# Altium schematic sheet 10scm153adp1_main.SchDoc
size A3; DocumentNumber: 1; SheetNumber: 1; SheetTotal: 3
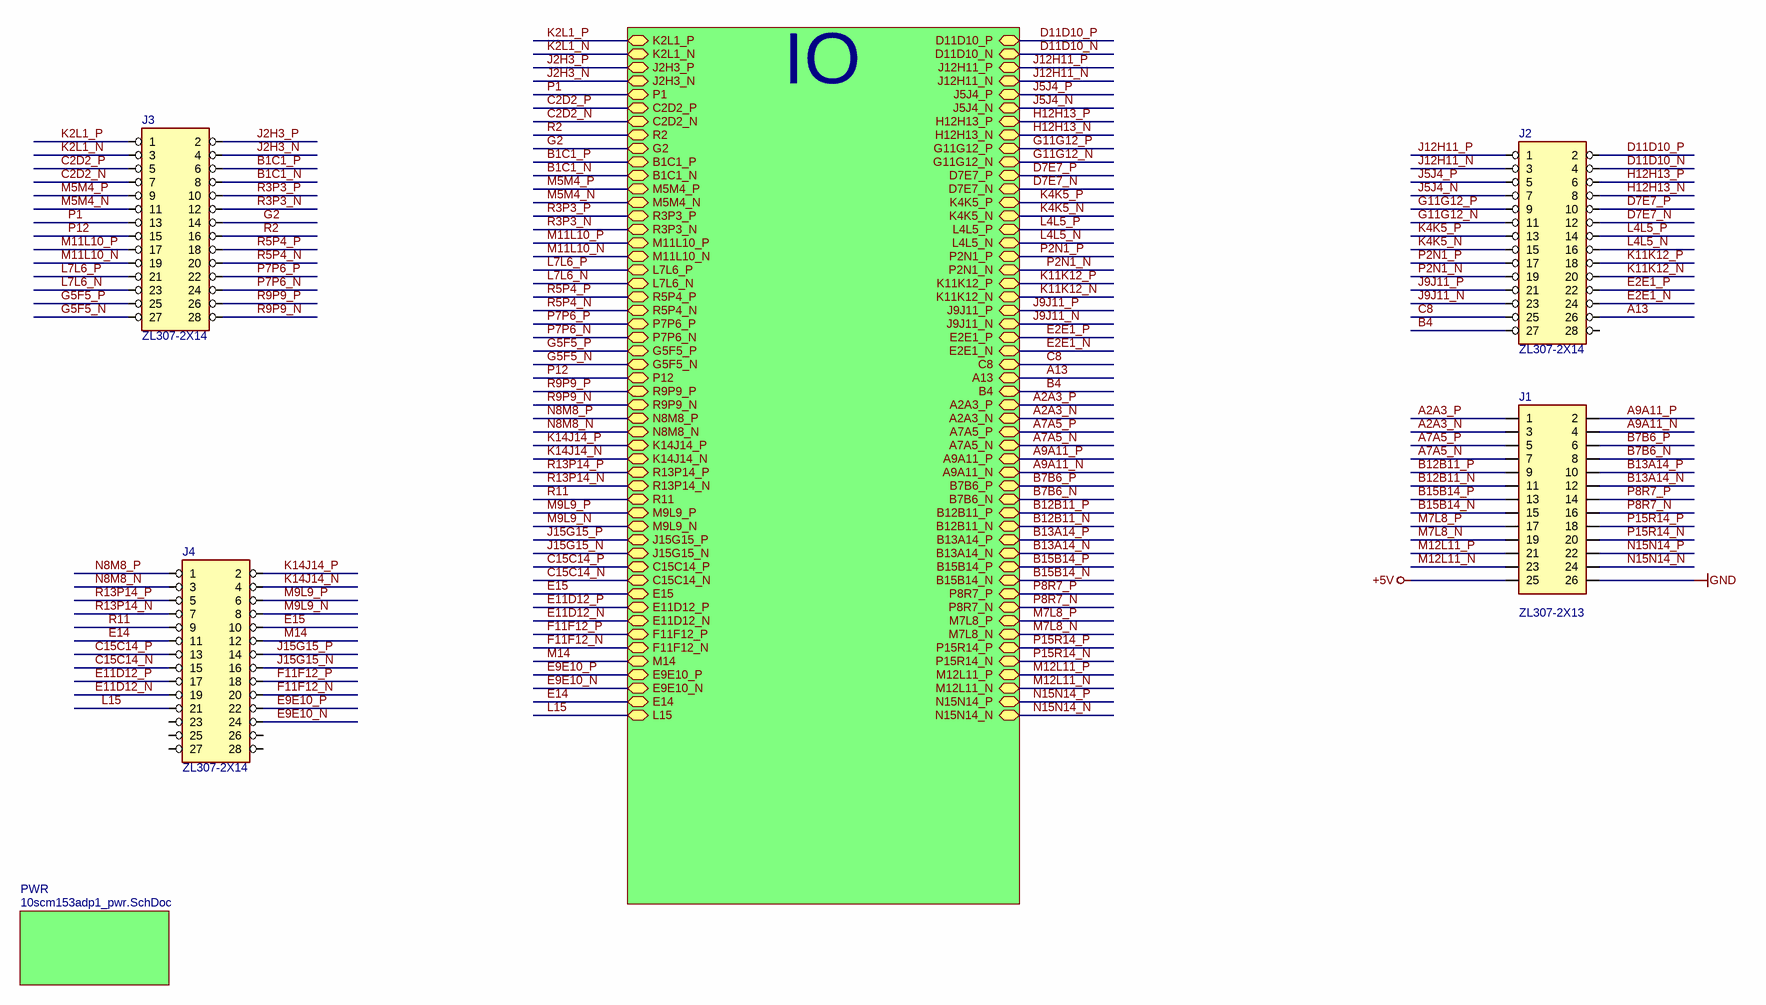
[diagram p0: 10scm153adp1_main.SchDoc]

## Parts
J1  ZL307-2X13  [ZL307-2X13]
J2  ZL307-2X14  [ZL307-2X14]
J3  ZL307-2X14  [ZL307-2X14]
J4  ZL307-2X14  [ZL307-2X14]

## Sub-sheets
IO = 10scm153adp1_io.SchDoc: P1 (bidir), R2 (bidir), G2 (bidir), P12 (bidir), R11 (bidir), E15 (bidir), M14 (bidir), E14 (bidir), L15 (bidir), C8 (bidir), A13 (bidir), B4 (bidir), M5M4_N (bidir), M5M4_P (bidir), R3P3_N (bidir), R3P3_P (bidir), L7L6_N (bidir), L7L6_P (bidir), R5P4_P (bidir), R5P4_N (bidir), P7P6_P (bidir), P7P6_N (bidir), P8R7_P (bidir), P8R7_N (bidir), M7L8_P (bidir), M7L8_N (bidir), R9P9_N (bidir), R9P9_P (bidir), N8M8_P (bidir), N8M8_N (bidir), P15R14_P (bidir), P15R14_N (bidir), M12L11_P (bidir), M12L11_N (bidir), N15N14_N (bidir), N15N14_P (bidir), K11K12_P (bidir), K11K12_N (bidir), J9J11_N (bidir), J9J11_P (bidir), M9L9_P (bidir), M9L9_N (bidir), M11L10_N (bidir), M11L10_P (bidir), R13P14_P (bidir), R13P14_N (bidir), K14J14_P (bidir), K14J14_N (bidir), J15G15_N (bidir), J15G15_P (bidir), C15C14_N (bidir), C15C14_P (bidir), E11D12_N (bidir), E11D12_P (bidir), F11F12_P (bidir), F11F12_N (bidir), C2D2_N (bidir), C2D2_P (bidir), B1C1_P (bidir), B1C1_N (bidir), E2E1_P (bidir), E2E1_N (bidir), G5F5_N (bidir), G5F5_P (bidir), J2H3_N (bidir), J2H3_P (bidir), K2L1_P (bidir), K2L1_N (bidir), A2A3_N (bidir), A2A3_P (bidir), A7A5_P (bidir), A7A5_N (bidir), A9A11_P (bidir), A9A11_N (bidir), B7B6_P (bidir), B7B6_N (bidir), B12B11_N (bidir), B12B11_P (bidir), B13A14_N (bidir), B13A14_P (bidir), B15B14_N (bidir), B15B14_P (bidir), D7E7_P (bidir), D7E7_N (bidir), D11D10_P (bidir), D11D10_N (bidir), E9E10_P (bidir), E9E10_N (bidir), G11G12_N (bidir), G11G12_P (bidir), H12H13_N (bidir), H12H13_P (bidir), J5J4_P (bidir), J5J4_N (bidir), J12H11_P (bidir), J12H11_N (bidir), K4K5_P (bidir), K4K5_N (bidir), L4L5_P (bidir), L4L5_N (bidir), P2N1_N (bidir), P2N1_P (bidir)
PWR = 10scm153adp1_pwr.SchDoc: no entries

## Nets
+5V: J1.25
GND: J1.26
A2A3_N: J1.3 ; sheet IO/A2A3_N
A2A3_P: J1.1 ; sheet IO/A2A3_P
A7A5_N: J1.7 ; sheet IO/A7A5_N
A7A5_P: J1.5 ; sheet IO/A7A5_P
A9A11_N: J1.4 ; sheet IO/A9A11_N
A9A11_P: J1.2 ; sheet IO/A9A11_P
A13: J2.26 ; sheet IO/A13
B1C1_N: J3.8 ; sheet IO/B1C1_N
B1C1_P: J3.6 ; sheet IO/B1C1_P
B4: J2.27 ; sheet IO/B4
B7B6_N: J1.8 ; sheet IO/B7B6_N
B7B6_P: J1.6 ; sheet IO/B7B6_P
B12B11_N: J1.11 ; sheet IO/B12B11_N
B12B11_P: J1.9 ; sheet IO/B12B11_P
B13A14_N: J1.12 ; sheet IO/B13A14_N
B13A14_P: J1.10 ; sheet IO/B13A14_P
B15B14_N: J1.15 ; sheet IO/B15B14_N
B15B14_P: J1.13 ; sheet IO/B15B14_P
C2D2_N: J3.7 ; sheet IO/C2D2_N
C2D2_P: J3.5 ; sheet IO/C2D2_P
C8: J2.25 ; sheet IO/C8
C15C14_N: J4.15 ; sheet IO/C15C14_N
C15C14_P: J4.13 ; sheet IO/C15C14_P
D7E7_N: J2.12 ; sheet IO/D7E7_N
D7E7_P: J2.10 ; sheet IO/D7E7_P
D11D10_N: J2.4 ; sheet IO/D11D10_N
D11D10_P: J2.2 ; sheet IO/D11D10_P
E2E1_N: J2.24 ; sheet IO/E2E1_N
E2E1_P: J2.22 ; sheet IO/E2E1_P
E9E10_N: J4.24 ; sheet IO/E9E10_N
E9E10_P: J4.22 ; sheet IO/E9E10_P
E11D12_N: J4.19 ; sheet IO/E11D12_N
E11D12_P: J4.17 ; sheet IO/E11D12_P
E14: J4.11 ; sheet IO/E14
E15: J4.10 ; sheet IO/E15
F11F12_N: J4.20 ; sheet IO/F11F12_N
F11F12_P: J4.18 ; sheet IO/F11F12_P
G2: J3.14 ; sheet IO/G2
G5F5_N: J3.27 ; sheet IO/G5F5_N
G5F5_P: J3.25 ; sheet IO/G5F5_P
G11G12_N: J2.11 ; sheet IO/G11G12_N
G11G12_P: J2.9 ; sheet IO/G11G12_P
H12H13_N: J2.8 ; sheet IO/H12H13_N
H12H13_P: J2.6 ; sheet IO/H12H13_P
J2H3_N: J3.4 ; sheet IO/J2H3_N
J2H3_P: J3.2 ; sheet IO/J2H3_P
J5J4_N: J2.7 ; sheet IO/J5J4_N
J5J4_P: J2.5 ; sheet IO/J5J4_P
J9J11_N: J2.23 ; sheet IO/J9J11_N
J9J11_P: J2.21 ; sheet IO/J9J11_P
J12H11_N: J2.3 ; sheet IO/J12H11_N
J12H11_P: J2.1 ; sheet IO/J12H11_P
J15G15_N: J4.16 ; sheet IO/J15G15_N
J15G15_P: J4.14 ; sheet IO/J15G15_P
K2L1_N: J3.3 ; sheet IO/K2L1_N
K2L1_P: J3.1 ; sheet IO/K2L1_P
K4K5_N: J2.15 ; sheet IO/K4K5_N
K4K5_P: J2.13 ; sheet IO/K4K5_P
K11K12_N: J2.20 ; sheet IO/K11K12_N
K11K12_P: J2.18 ; sheet IO/K11K12_P
K14J14_N: J4.4 ; sheet IO/K14J14_N
K14J14_P: J4.2 ; sheet IO/K14J14_P
L4L5_N: J2.16 ; sheet IO/L4L5_N
L4L5_P: J2.14 ; sheet IO/L4L5_P
L7L6_N: J3.23 ; sheet IO/L7L6_N
L7L6_P: J3.21 ; sheet IO/L7L6_P
L15: J4.21 ; sheet IO/L15
M5M4_N: J3.11 ; sheet IO/M5M4_N
M5M4_P: J3.9 ; sheet IO/M5M4_P
M7L8_N: J1.19 ; sheet IO/M7L8_N
M7L8_P: J1.17 ; sheet IO/M7L8_P
M9L9_N: J4.8 ; sheet IO/M9L9_N
M9L9_P: J4.6 ; sheet IO/M9L9_P
M11L10_N: J3.19 ; sheet IO/M11L10_N
M11L10_P: J3.17 ; sheet IO/M11L10_P
M12L11_N: J1.23 ; sheet IO/M12L11_N
M12L11_P: J1.21 ; sheet IO/M12L11_P
M14: J4.12 ; sheet IO/M14
N8M8_N: J4.3 ; sheet IO/N8M8_N
N8M8_P: J4.1 ; sheet IO/N8M8_P
N15N14_N: J1.24 ; sheet IO/N15N14_N
N15N14_P: J1.22 ; sheet IO/N15N14_P
P1: J3.13 ; sheet IO/P1
P2N1_N: J2.19 ; sheet IO/P2N1_N
P2N1_P: J2.17 ; sheet IO/P2N1_P
P7P6_N: J3.24 ; sheet IO/P7P6_N
P7P6_P: J3.22 ; sheet IO/P7P6_P
P8R7_N: J1.16 ; sheet IO/P8R7_N
P8R7_P: J1.14 ; sheet IO/P8R7_P
P12: J3.15 ; sheet IO/P12
P15R14_N: J1.20 ; sheet IO/P15R14_N
P15R14_P: J1.18 ; sheet IO/P15R14_P
R2: J3.16 ; sheet IO/R2
R3P3_N: J3.12 ; sheet IO/R3P3_N
R3P3_P: J3.10 ; sheet IO/R3P3_P
R5P4_N: J3.20 ; sheet IO/R5P4_N
R5P4_P: J3.18 ; sheet IO/R5P4_P
R9P9_N: J3.28 ; sheet IO/R9P9_N
R9P9_P: J3.26 ; sheet IO/R9P9_P
R11: J4.9 ; sheet IO/R11
R13P14_N: J4.7 ; sheet IO/R13P14_N
R13P14_P: J4.5 ; sheet IO/R13P14_P

Not connected (* = marked no-connect by the designer): J2 28; J4 23 25 26 27 28

## Notes on the sheet
- Nazwa modułu (skrót)
- Słowna nazwa modułu
- Rozmiar arkusza
- A3
- Zatwierdził
- Projektował
- Rysował
- Podpis
- ATM
- Data:
- Ark.
- z
- Wer.

## Library data of the parts
J1 = CON85: Kod: CON85; ID: 85; Descript: Gniazdo; kołkowe; żeńskie; PIN: 80; toczone styki; proste; 2,54mm, wycięte 2x13 pinów; Reference5: ZL307-2X40; Typ5: DS1002-03-2*40131; Replacement: bd; Value: ZL307-2X13; Price5: 12; DateOfPrice5: 05-01-2021; Supplier5: tme; Manufacturer5: Connfly
J2-J4 = CON84: Kod: CON84; ID: 84; Descript: Gniazdo; kołkowe; żeńskie; PIN: 80; toczone styki; proste; 2,54mm, wycięte 2x14 pinów; Reference5: ZL307-2X40; Typ5: DS1002-03-2*40131; Replacement: bd; Value: ZL307-2X14; Price5: 20; DateOfPrice5: 05-01-2021; Supplier5: tme; Manufacturer5: Connfly